# Altium schematic sheet USB_input_and_Power.SchDoc
size A4; SheetNumber: 1; SheetTotal: 13
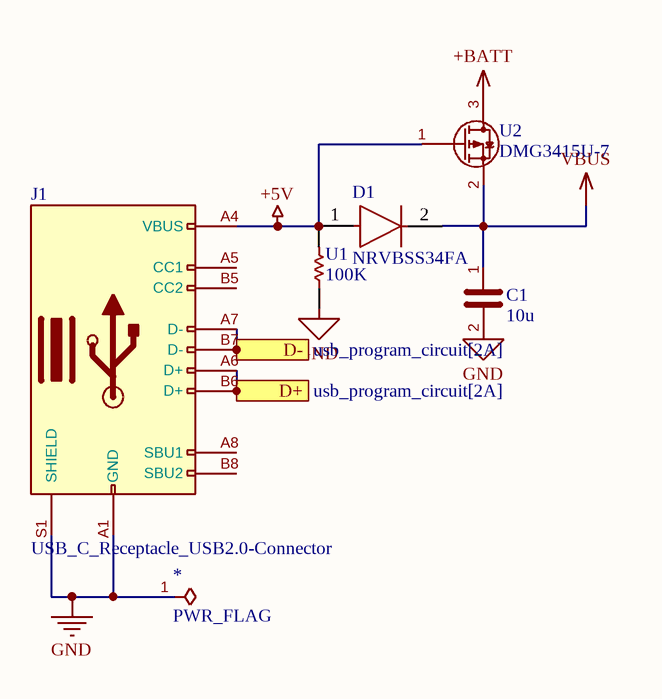
[diagram p0: USB_input_and_Power.SchDoc]

## Parts
*  PWR_FLAG  (graphical)
C1  10u  [CAPC2013X70X45NL10T25]
D1  NRVBSS34FA  [NRVBSS34FA]
J1  USB_C_Receptacle_USB2.0-Connector  [Type C USB Connector]
U1  100K  [RESC2013X70X40NL20T20]
U2  DMG3415U-7  [DMG3415U-7]

## Ports
D+ (see usb_program_circuit[2A]), D- (see usb_program_circuit[2A])

## Nets
+5V: D1.1 J1.A4(VBUS) U1.2 U2.1(G)
+BATT: U2.3(D)
GND: *.1(pwr) C1.2 J1.A1(GND) J1.S1(SHIELD) U1.1
VBUS: C1.1 D1.2 U2.2(S)
D+: J1.A6(D+) J1.B6(D+) ; port D+
D-: J1.A7(D-) J1.B7(D-) ; port D-

Not connected (* = marked no-connect by the designer): J1 A5(CC1) A8(SBU1) A9(VBUS) A12(GND) B1(GND) B4(VBUS) B5(CC2) B8(SBU2) B9(VBUS) B12(GND)

## Library data of the parts
C1 = C
D1 = CMP-00278-103808874-1: NRVBSS34FA Schottky Barrier Rectifier Diode 40V 3A 2-Pin SOD−123FL T/R; Manufacturer Lifecycle Status: ACTIVE; Max Junction Temperature (Tj): 125°C; Capacitance: 152pF; Peak Reverse Current: 500µA; Max Forward Surge Current (Ifsm): 80A; RoHS: Compliant; Forward Current: 3A; Height: 1.43mm; Max Operating Temperature: 125°C; Min Operating Temperature: -55°C; Lifecycle Status: Production; Max Repetitive Reverse Voltage (Vrrm): 40V; Reverse Voltage: 40V; NexarPartId: 103808874
U1 = CMP-2100-03671-1: Chip Resistor, 1 KOhm, +/- 1%, 125 mW, -55 to 155 degC, 0805 (2012 Metric), RoHS, Tape and Reel; Manufacturer: Yageo; Temperature Coefficient: 100ppm/degreesC; Voltage Rating (DC): 150V; Max Power Dissipation: 125mW; Resistance: 1KOhm; Number of Pins: 2; Number of Terminations: 2; Datasheet URL: http://www.yageo.com/NewPortal/yageodocoutput?fileName=/pdf/R-Chip/PYu-RC_Group_51_RoHS_L_5.pdf; Length: 0.079inch; Package Description: 2-Pin Surface Mounted Device, Body 2 x 1.25 mm; Depth: 1.25mm; Height: 0.024inch; Military Standard: Not; Case/Package: 0805; Package Reference: 0805; RoHSCompliant: true; Lead Free: LeadFree; Packaging: TapeandReel; Package Quantity: 1; Datasheet Version: Rev. 5, 10/2016; Tolerance: 1%; Min Operating Temperature: -55degC; Voltage Rating: 150V; Composition: ThickFilm; Case Code (Imperial): 0805; Power Rating: 125mW; Width: 0.049inch; Case Code (Metric): 2012; Manufacturer URL: http://www.yageo.com/; Max Operating Temperature: 155degC; REACH SVHC: Unknown; Termination: SMD/SMT